# Altium schematic sheet Output_stages.SchDoc
size A4
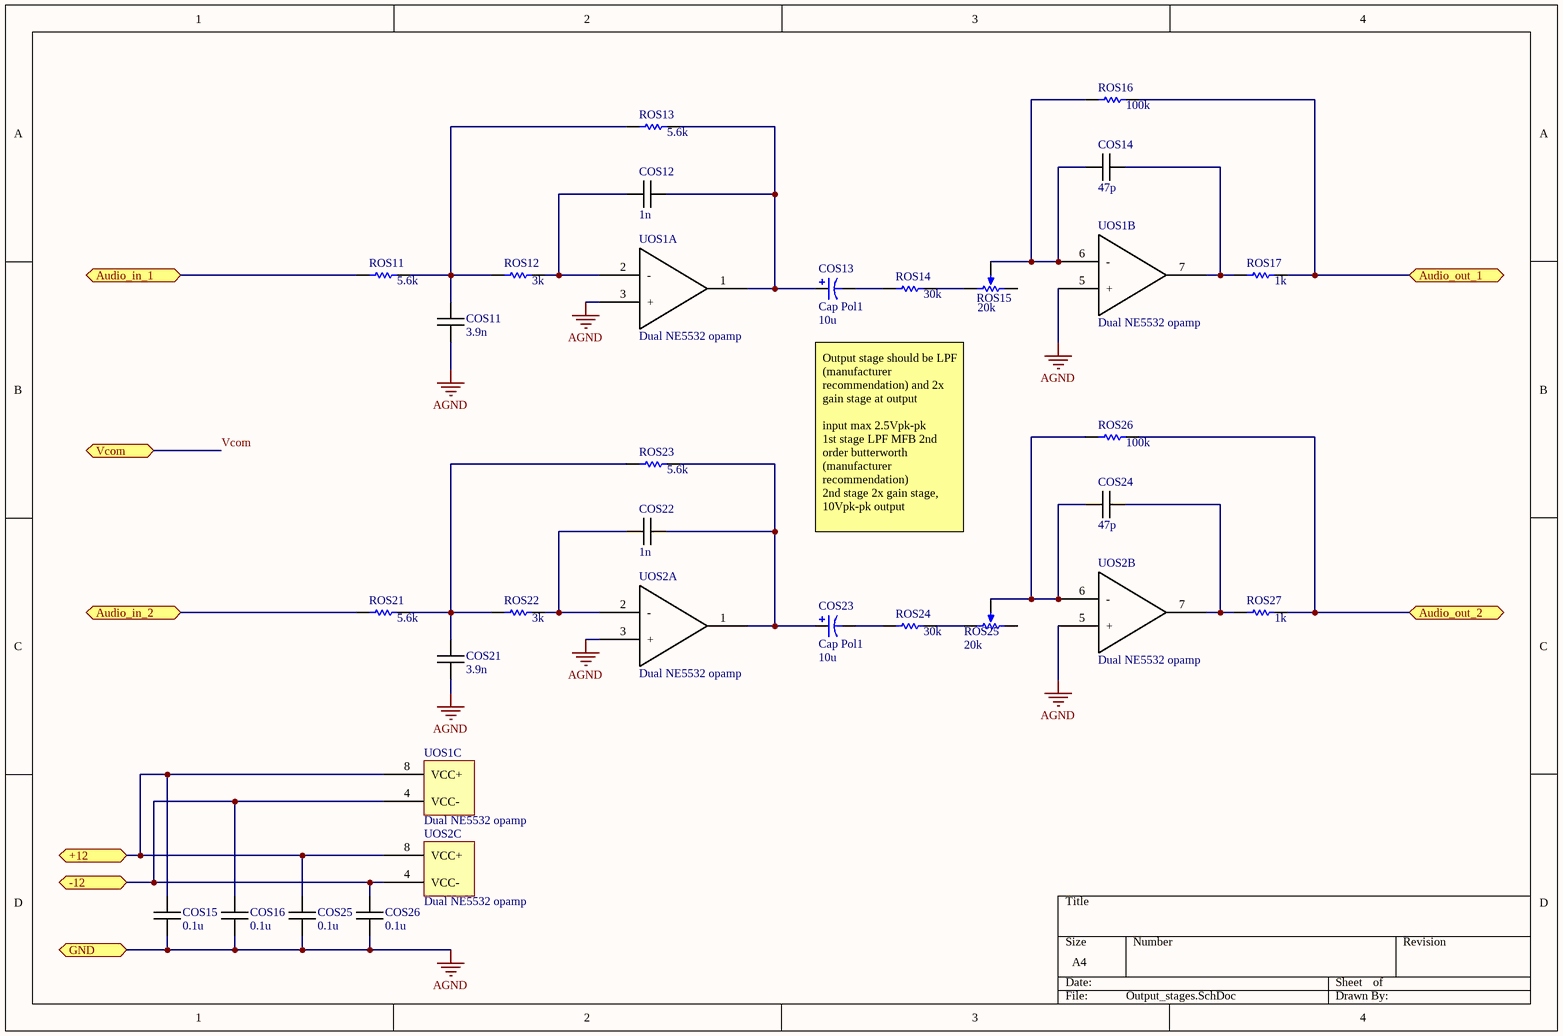
[diagram p0: Output_stages.SchDoc]

## Parts
COS11  3.9n  [C 0603 / 1608]
COS12  1n  [C 0603 / 1608]
COS13  Cap Pol1  value 10u  [RB7.6-15]
COS14  47p  [C 0603 / 1608]
COS15  0.1u  [C 0603 / 1608]
COS16  0.1u  [C 0603 / 1608]
COS21  3.9n  [C 0603 / 1608]
COS22  1n  [C 0603 / 1608]
COS23  Cap Pol1  value 10u  [RB7.6-15]
COS24  47p  [C 0603 / 1608]
COS25  0.1u  [C 0603 / 1608]
COS26  0.1u  [C 0603 / 1608]
ROS11  value 5.6k  [RES0603R]
ROS12  value 3k  [RES0603R]
ROS13  value 5.6k  [RES0603R]
ROS14  value 30k  [RES0603R]
ROS15  value 20k  [SMD_POT_3x3mm]
ROS16  value 100k  [RES0603R]
ROS17  value 1k  [RES0603R]
ROS21  value 5.6k  [RES0603R]
ROS22  value 3k  [RES0603R]
ROS23  value 5.6k  [RES0603R]
ROS24  value 30k  [RES0603R]
ROS25  value 20k  [SMD_POT_3x3mm]
ROS26  value 100k  [RES0603R]
ROS27  value 1k  [RES0603R]
UOS1  Dual NE5532 opamp  (parts A,B,C of 3)
UOS2  Dual NE5532 opamp  (parts A,B,C of 3)

## Ports
+12 (bidir), -12 (bidir), Audio_in_1 (bidir), Audio_in_2 (bidir), Audio_out_1 (bidir), Audio_out_2 (bidir), GND (bidir), Vcom (bidir)

## Nets
AGND: COS11.1 COS15.1 COS16.1 COS21.1 COS25.1 COS26.1 UOS1.3(+) UOS1.5(+) UOS2.3(+) UOS2.5(+) ; port GND
+12: COS15.2 COS25.2 UOS1.8(VCC+) UOS2.8(VCC+) ; port +12
-12: COS16.2 COS26.2 UOS1.4(VCC-) UOS2.4(VCC-) ; port -12
Audio_in_1: ROS11.1 ; port Audio_in_1
Audio_in_2: ROS21.1 ; port Audio_in_2
Audio_out_1: ROS16.2 ROS17.2 ; port Audio_out_1
Audio_out_2: ROS26.2 ROS27.2 ; port Audio_out_2
Vcom: port Vcom
NetCOS11_2: COS11.2 ROS11.2 ROS12.1 ROS13.1
NetCOS12_1: COS12.1 ROS12.2 UOS1.2(-)
NetCOS12_2: COS12.2 COS13.1 ROS13.2 UOS1.1(OUT)
NetCOS13_2: COS13.2 ROS14.1
NetCOS14_1: COS14.1 ROS15.3(TAP) ROS16.1 UOS1.6(-)
NetCOS14_2: COS14.2 ROS17.1 UOS1.7(OUT)
NetCOS21_2: COS21.2 ROS21.2 ROS22.1 ROS23.1
NetCOS22_1: COS22.1 ROS22.2 UOS2.2(-)
NetCOS22_2: COS22.2 COS23.1 ROS23.2 UOS2.1(OUT)
NetCOS23_2: COS23.2 ROS24.1
NetCOS24_1: COS24.1 ROS25.3(TAP) ROS26.1 UOS2.6(-)
NetCOS24_2: COS24.2 ROS27.1 UOS2.7(OUT)
NetROS14_2: ROS14.2 ROS15.2(BOT)
NetROS24_2: ROS24.2 ROS25.2(BOT)

Not connected (* = marked no-connect by the designer): ROS15 1(TOP); ROS25 1(TOP)

## Notes on the sheet
- Output stage should be LPF (manufacturer recommendation) and 2x gain stage at output
  input max 2.5Vpk-pk
  1st stage LPF MFB 2nd order butterworth (manufacturer recommendation)
  2nd stage 2x gain stage, 10Vpk-pk output

## Library data of the parts
COS11 COS12 COS14-COS16 COS21 COS22 COS24-COS26 = Capacitor: Value: asdasd
COS13 COS23 = Cap Pol1: Polarized Capacitor (Radial); Published: 8-Jun-2000; LatestRevisionDate: 17-Jul-2002; LatestRevisionNote: Re-released for DXP Platform.; PackageReference: RB7.6-15; Publisher: Altium Limited; PackageDescription: Polarized Capacitor (Radial); 2 Leads
ROS11-ROS14 ROS16 ROS17 ROS21-ROS24 ROS26 ROS27 = Res1: Resistor; Published: 8-Jun-2000; LatestRevisionDate: 17-Jul-2002; LatestRevisionNote: Re-released for DXP Platform.; PackageReference: AXIAL-0.3; Publisher: Altium Limited; PackageDescription: Axial Device, Thru-Hole; 2 Leads; 0.3 in Pin Spacing
ROS15 ROS25 = RPot: Potentiometer; Sim Note: Enter the Resistance value and the set point into parameter fields.; Set Position: 0.5; Published: 8-Jun-2000; LatestRevisionDate: 17-Jul-2002; LatestRevisionNote: Re-released for DXP Platform.; PackageReference: VR5; Publisher: Altium Limited; PackageDescription: Variable Resistor, Thru-Hole; 3 Leads
UOS1 UOS2 = NE5532